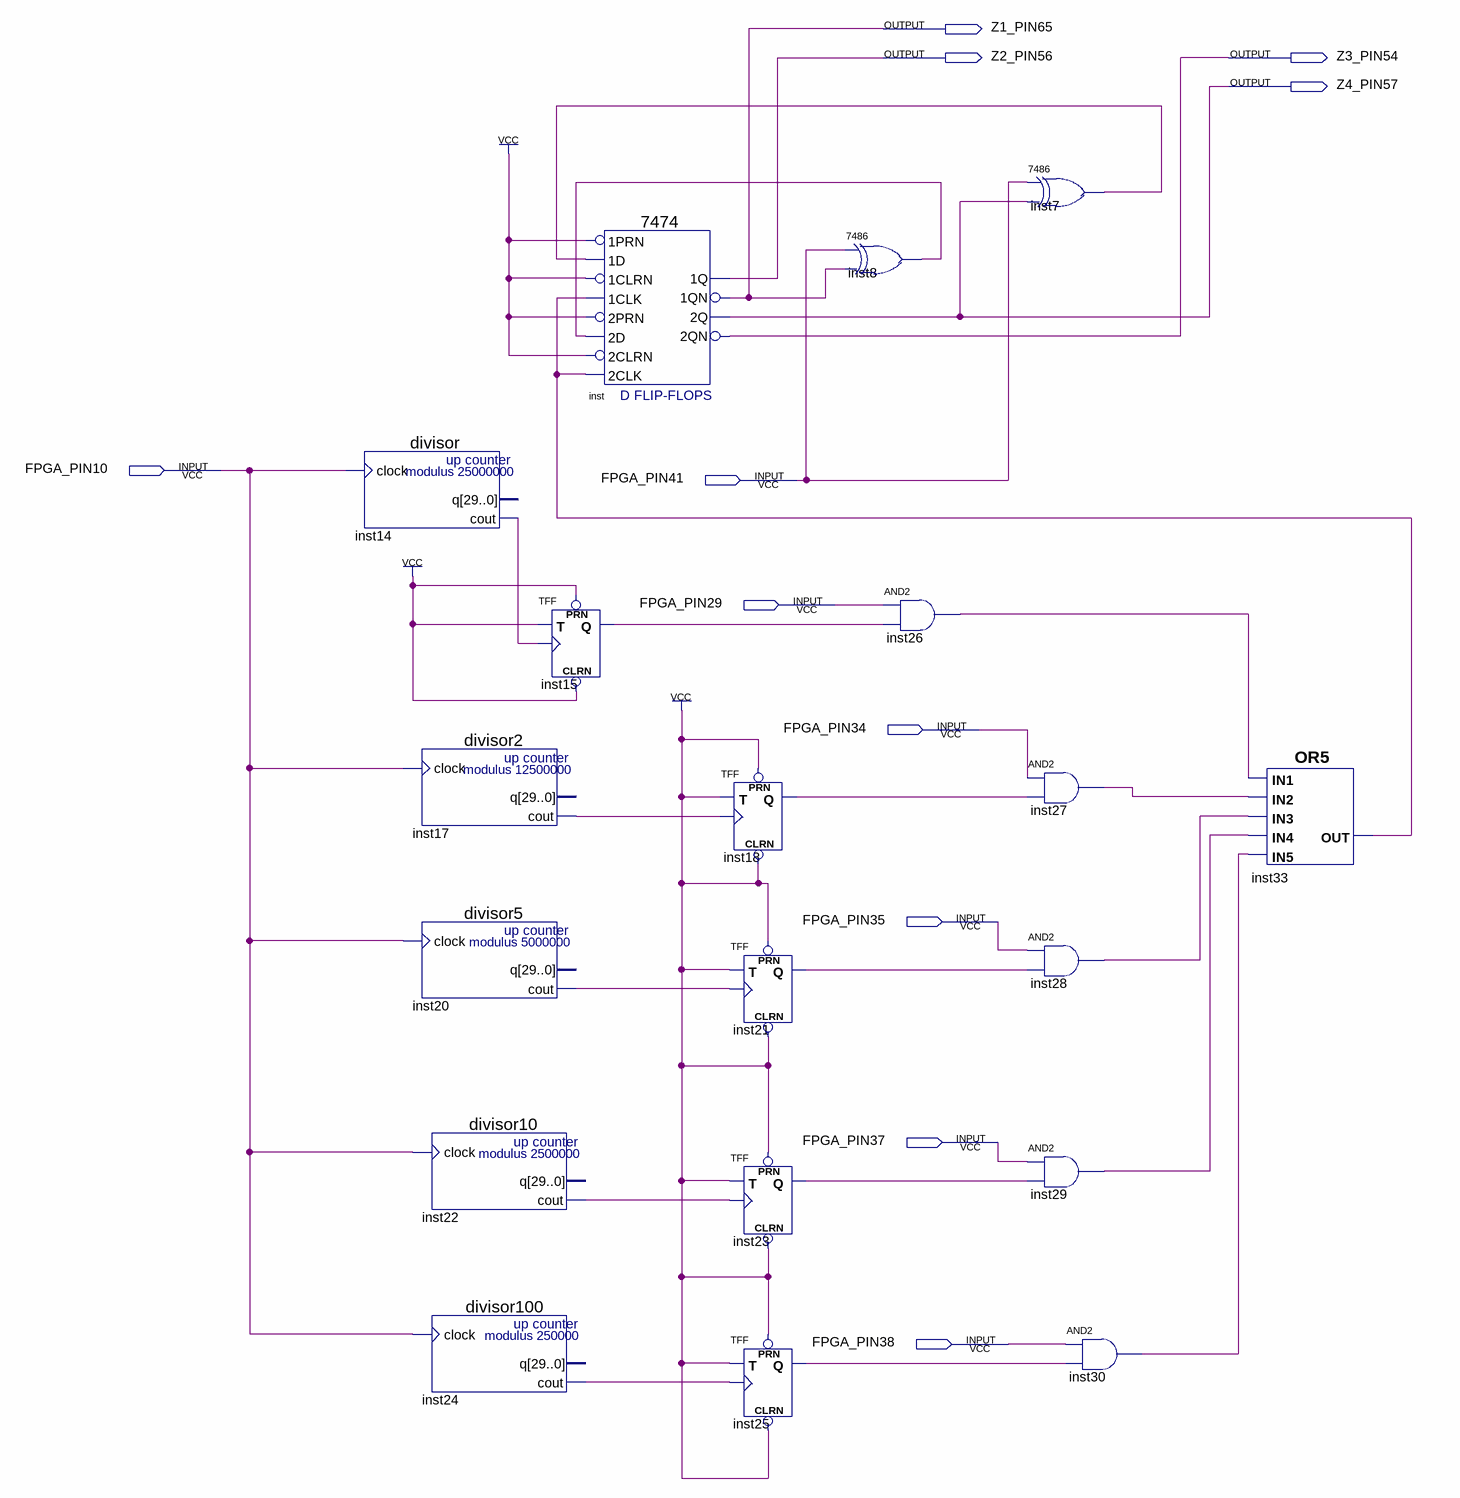
[diagram p0: schematic sheet]
// Quartus schematic ControleMotorPasso.bdf as structural Verilog: 19 symbols, 11 pins
module ControleMotorPasso (
  input  FPGA_PIN10,
  input  FPGA_PIN41,
  input  FPGA_PIN29,
  input  FPGA_PIN34,
  input  FPGA_PIN35,
  input  FPGA_PIN37,
  input  FPGA_PIN38,
  output Z1_PIN65,
  output Z2_PIN56,
  output Z3_PIN54,
  output Z4_PIN57
);

  wire inst7_1, inst8_1, inst14_cout, inst15_q, inst17_cout, inst18_q, inst20_cout, inst21_q, inst22_cout,
       inst23_q, inst24_cout, inst25_q, inst26_out, inst27_out, inst28_out, inst29_out, inst30_out,
       inst33_out;

  divisor inst14 (.clock(FPGA_PIN10), .cout(inst14_cout));  // open: q
  divisor2 inst17 (.clock(FPGA_PIN10), .cout(inst17_cout));  // open: q
  divisor5 inst20 (.clock(FPGA_PIN10), .cout(inst20_cout));  // open: q
  divisor10 inst22 (.clock(FPGA_PIN10), .cout(inst22_cout));  // open: q
  divisor100 inst24 (.clock(FPGA_PIN10), .cout(inst24_cout));  // open: q
  TFF inst15 (.PRN(1'b1), .CLRN(1'b1), .T(1'b1), .CLK(inst14_cout), .Q(inst15_q));
  \7474  inst (
    .\2D (inst8_1), .\2PRN (1'b1), .\1CLK (inst33_out), .\1D (inst7_1), .\1PRN (1'b1), .\2CLK (inst33_out),
    .\2CLRN (1'b1), .\1CLRN (1'b1), .\1QN (Z1_PIN65), .\2Q (Z4_PIN57), .\2QN (Z3_PIN54), .\1Q (Z2_PIN56));
  TFF inst18 (.PRN(1'b1), .CLRN(1'b1), .T(1'b1), .CLK(inst17_cout), .Q(inst18_q));
  TFF inst21 (.PRN(1'b1), .CLRN(1'b1), .T(1'b1), .CLK(inst20_cout), .Q(inst21_q));
  TFF inst23 (.PRN(1'b1), .CLRN(1'b1), .T(1'b1), .CLK(inst22_cout), .Q(inst23_q));
  TFF inst25 (.PRN(1'b1), .CLRN(1'b1), .T(1'b1), .CLK(inst24_cout), .Q(inst25_q));
  \7486  inst8 (.\2 (FPGA_PIN41), .\3 (Z1_PIN65), .\1 (inst8_1));
  and inst26 (inst26_out, FPGA_PIN29, inst15_q);
  \7486  inst7 (.\2 (FPGA_PIN41), .\3 (Z4_PIN57), .\1 (inst7_1));
  and inst27 (inst27_out, FPGA_PIN34, inst18_q);
  and inst28 (inst28_out, FPGA_PIN35, inst21_q);
  and inst29 (inst29_out, FPGA_PIN37, inst23_q);
  and inst30 (inst30_out, FPGA_PIN38, inst25_q);
  or inst33 (inst33_out, inst26_out, inst27_out, inst28_out, inst29_out, inst30_out);
endmodule
